# Altium schematic sheet screw.SchDoc
size A4; SheetNumber: 8; SheetTotal: 8
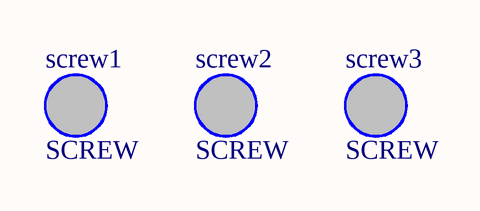
[diagram p0: screw.SchDoc]

## Parts
screw1  SCREW  [SCREW]
screw2  SCREW  [SCREW]
screw3  SCREW  [SCREW]